# Altium schematic sheet NCKH_sch.SchDoc
size A0
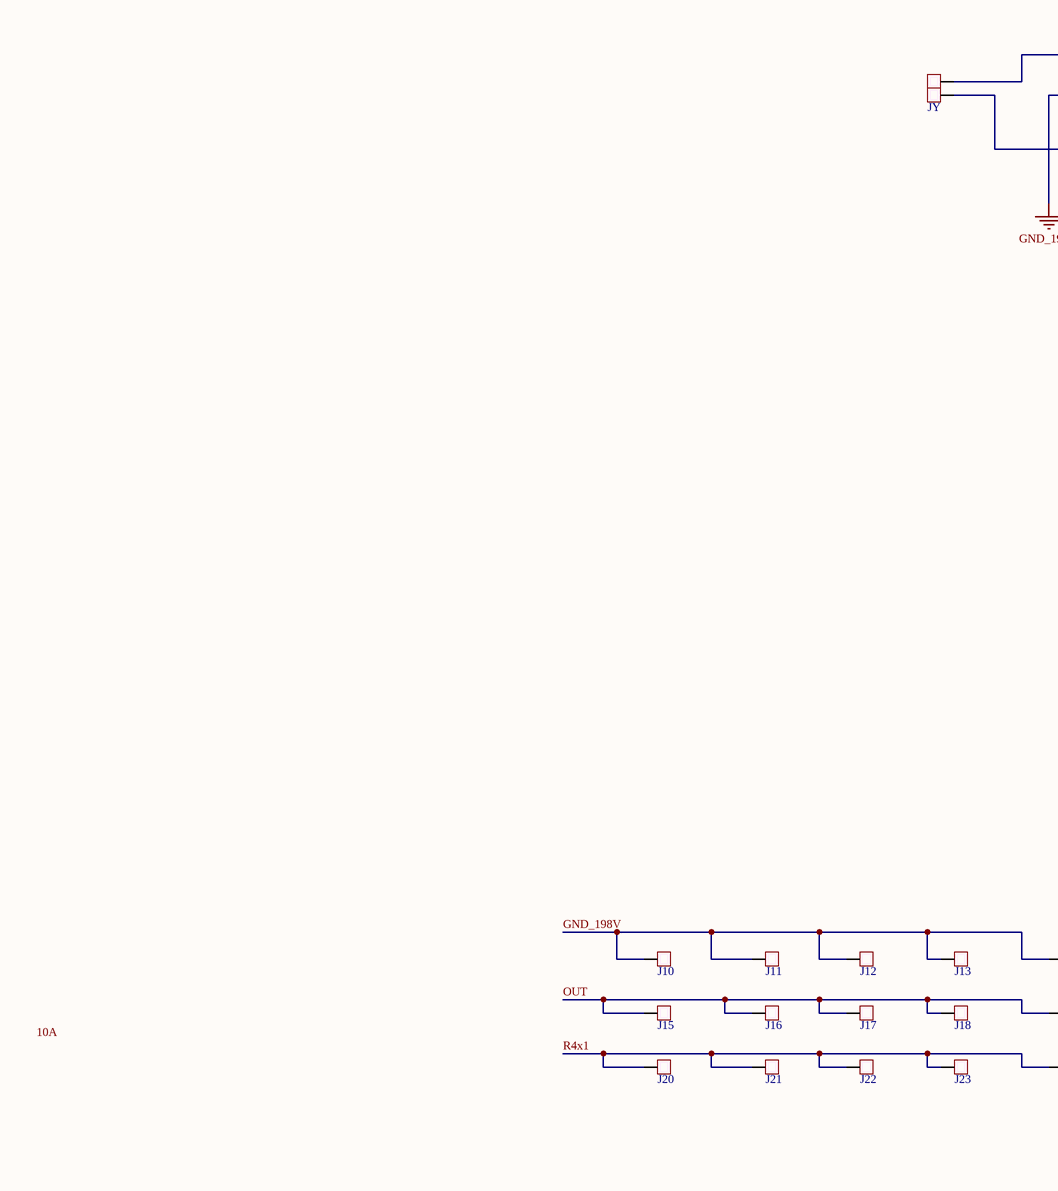
[diagram p0: NCKH_sch.SchDoc, left]
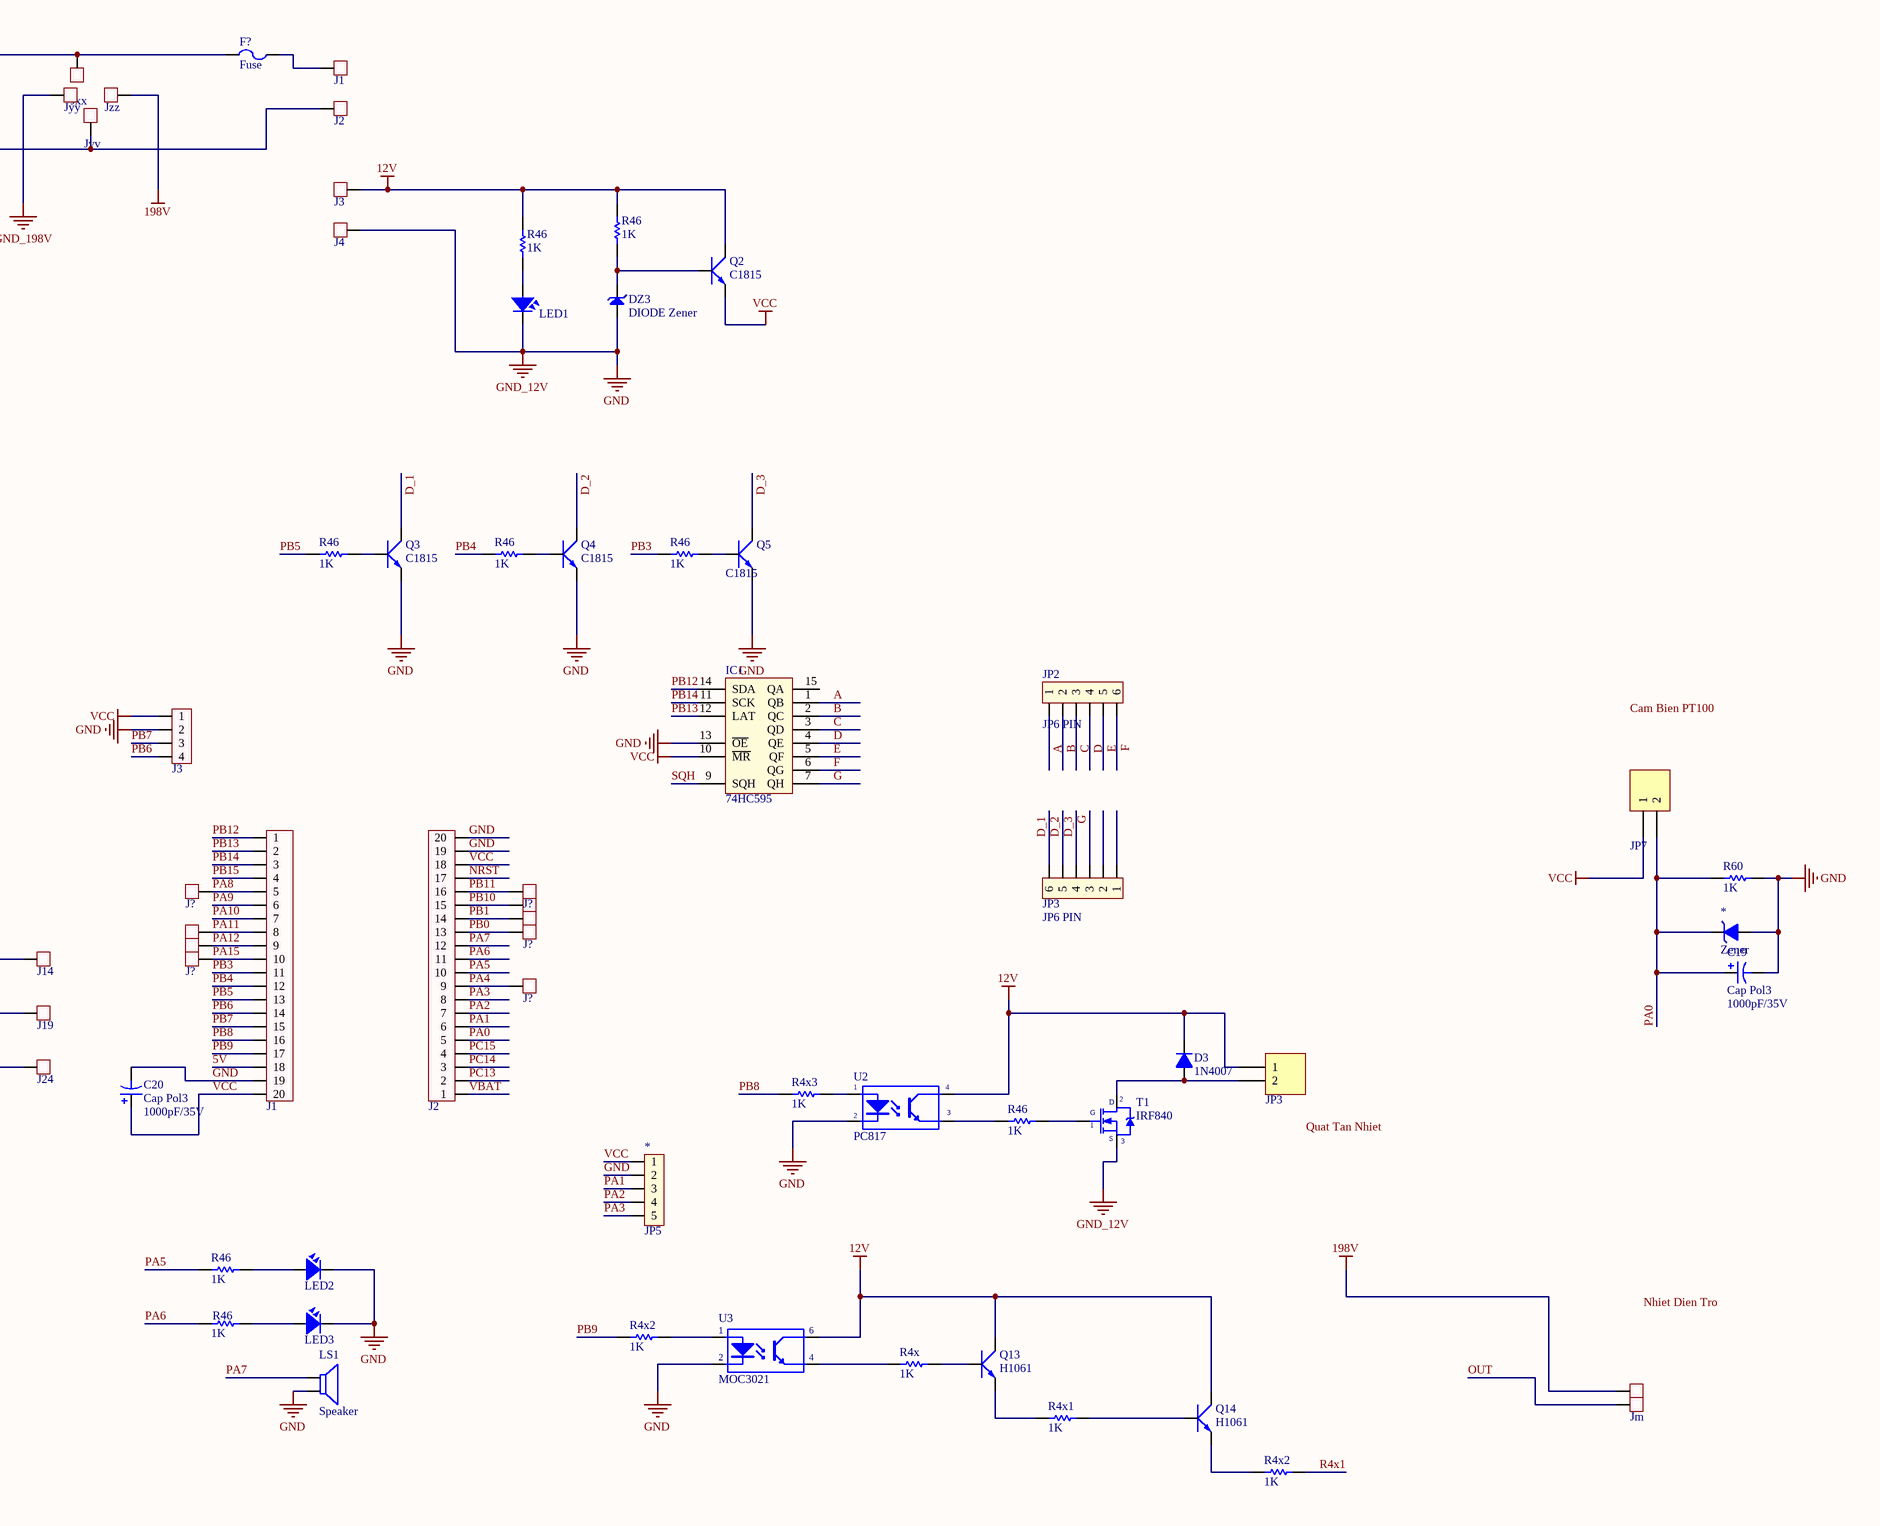
[diagram p1: NCKH_sch.SchDoc, right]

## Parts
(Parts that share a designator on the sheet are numbered #1, #2 ... from top to bottom, then left to right.)
*#1  Zener  [D1A]
*#2  JP5  [JP5]
C19  Cap Pol3  value 1000pF/35V  [CA-040,015]
C20  Cap Pol3  value 1000pF/35V  [CA-040,015]
D3  1N4007  [D1A]
DZ3  DIODE Zener  [DIO-1A]
F?  Fuse  [Fuse4]
IC1  74HC595  [DIP16/W0.3]
J1#1  JP1  [JP1-D1T]  (value not drawn)
J1#2  JP20  [JP20-C1T]  (value not drawn)
J2#1  JP1  [JP1-D1T]  (value not drawn)
J2#2  JP20  [JP20-C1T]  (value not drawn)
J3#1  JP1  [JP1-D1T]  (value not drawn)
J3#2  JP4  [JP4-C1T]  (value not drawn)
J4  JP1  [JP1-D1T]  (value not drawn)
J10  JP1  [JP1-D1T]  (value not drawn)
J11  JP1  [JP1-D1T]  (value not drawn)
J12  JP1  [JP1-D1T]  (value not drawn)
J13  JP1  [JP1-D1T]  (value not drawn)
J14  JP1  [JP1-D1T]  (value not drawn)
J15  JP1  [JP1-D1T]  (value not drawn)
J16  JP1  [JP1-D1T]  (value not drawn)
J17  JP1  [JP1-D1T]  (value not drawn)
J18  JP1  [JP1-D1T]  (value not drawn)
J19  JP1  [JP1-D1T]  (value not drawn)
J20  JP1  [JP1-D1T]  (value not drawn)
J21  JP1  [JP1-D1T]  (value not drawn)
J22  JP1  [JP1-D1T]  (value not drawn)
J23  JP1  [JP1-D1T]  (value not drawn)
J24  JP1  [JP1-D1T]  (value not drawn)
J?#1  JP1  [JP1-D1T]  (value not drawn)
J?#2  JP1  [JP1-D1T]  (value not drawn)
J?#3  JP1  [JP1-D1T]  (value not drawn)
J?#4  JP1  [JP1-D1T]  (value not drawn)
J?#5  JP1  [JP1-D1T]  (value not drawn)
J?#6  JP1  [JP1-D1T]  (value not drawn)
J?#7  JP1  [JP1-D1T]  (value not drawn)
J?#8  JP1  [JP1-D1T]  (value not drawn)
J?#9  JP1  [JP1-D1T]  (value not drawn)
Jk  JP1  [JP1-D1T]  (value not drawn)
Jm  JP1  [JP1-D1T]  (value not drawn)
JP2  JP6 PIN  [JP6]
JP3#1  JP6 PIN  [JP6]
JP3#2  Header 2_1  [HED2]  (value not drawn)
JP7  Header 2_1  [HED2]  (value not drawn)
Jvv  JP1  [JP1-D1T]  (value not drawn)
JX  JP1  [JP1-D1T]  (value not drawn)
Jxx  JP1  [JP1-D1T]  (value not drawn)
JY  JP1  [JP1-D1T]  (value not drawn)
Jyy  JP1  [JP1-D1T]  (value not drawn)
Jzz  JP1  [JP1-D1T]  (value not drawn)
LED1  LED  [LED-3]  (value not drawn)
LED2  LED  [LED-3]  (value not drawn)
LED3  LED  [LED-3]  (value not drawn)
LS1  Speaker  [SPEAKER]
Q2  C1815  [QTO-92]
Q3  C1815  [QTO-92]
Q4  C1815  [QTO-92]
Q5  C1815  [QTO-92]
Q13  H1061  [QTO-220]
Q14  H1061  [QTO-220]
R4x  value 1K  [R1/4W]  (hidden comment: Res1)
R4x1  value 1K  [R1/4W]  (hidden comment: Res1)
R4x2#1  value 1K  [R1/4W]  (hidden comment: Res1)
R4x2#2  value 1K  [R1/4W]  (hidden comment: Res1)
R4x3  value 1K  [R1/4W]  (hidden comment: Res1)
R46#1  value 1K  [R1/4W]  (hidden comment: Res1)
R46#2  value 1K  [R1/4W]  (hidden comment: Res1)
R46#3  value 1K  [R1/4W]  (hidden comment: Res1)
R46#4  value 1K  [R1/4W]  (hidden comment: Res1)
R46#5  value 1K  [R1/4W]  (hidden comment: Res1)
R46#6  value 1K  [R1/4W]  (hidden comment: Res1)
R46#7  value 1K  [R1/4W]  (hidden comment: Res1)
R46#8  value 1K  [R1/4W]  (hidden comment: Res1)
R60  value 1K  [R1/4W]  (hidden comment: Res1)
T1  IRF840  [TO220H1]
U2  PC817  [DIP4/W0.3]
U3  MOC3021  [DIP6/W0.3]

## Nets
12V: D3.2(K) J3#1.1 JP3#2.1 Q2.2(C) Q13.2(C) Q14.2(C) R46#1.1 R46#2.2 U2.4(C) U3.6(C)
198V: Jk.1 Jzz.1
GND: *#1.1(A) *#2.2 C19.2 C20.2 DZ3.1(A) IC1.8(GND) IC1.13(~{OE}) J1#2.19 J2#2.19 J2#2.20 J3#2.2 J4.1 LED1.2 LED2.2 LED3.2 LS1.2 Q3.1(E) Q4.1(E) Q5.1(E) R60.1 T1.3(S) U2.2(K) U3.2(K)  [also labelled GND_12V]
GND_198V: J10.1 J11.1 J12.1 J13.1 J14.1 Jyy.1
VCC: *#2.1 C20.1 IC1.10(~{MR}) IC1.16(VCC) J1#2.20 J2#2.18 J3#2.1 JP7.1 Q2.1(E)
5V: J1#2.18
A: IC1.1(QB) JP2.1
B: IC1.2(QC) JP2.2
C: IC1.3(QD) JP2.3
D: IC1.4(QE) JP2.4
D_1: JP3#1.6 Q3.2(C)
D_2: JP3#1.5 Q4.2(C)
D_3: JP3#1.4 Q5.2(C)
E: IC1.5(QF) JP2.5
F: IC1.6(QG) JP2.6
G: IC1.7(QH) JP3#1.3
NRST: J2#2.17
OUT: J15.1 J16.1 J17.1 J18.1 J19.1 Jm.1
PA0: *#1.2(K) C19.1 J2#2.5 JP7.2 R60.2
PA1: *#2.3 J2#2.6
PA2: *#2.4 J2#2.7
PA3: *#2.5 J2#2.8
PA4: J2#2.9 J?#9.1
PA5: J2#2.10 R46#7.2
PA6: J2#2.11 R46#8.2
PA7: J2#2.12 LS1.1
PA8: J1#2.5 J?#1.1
PA9: J1#2.6
PA10: J1#2.7
PA11: J1#2.8 J?#5.1
PA12: J1#2.9 J?#7.1
PA15: J1#2.10 J?#8.1
PB0: J2#2.13 J?#6.1
PB1: J2#2.14 J?#4.1
PB3: J1#2.11 R46#5.2
PB4: J1#2.12 R46#4.2
PB5: J1#2.13 R46#3.2
PB6: J1#2.14 J3#2.4
PB7: J1#2.15 J3#2.3
PB8: J1#2.16 R4x3.2
PB9: J1#2.17 R4x2#1.2
PB10: J2#2.15 J?#3.1
PB11: J2#2.16 J?#2.1
PB12: IC1.14(SDA) J1#2.1
PB13: IC1.12(LAT) J1#2.2
PB14: IC1.11(SCK) J1#2.3
PB15: J1#2.4
PC13: J2#2.2
PC14: J2#2.3
PC15: J2#2.4
R4x1: J20.1 J21.1 J22.1 J23.1 J24.1 R4x2#2.1
SQH: IC1.9(SQH)
VBAT: J2#2.1
NetD3_1: D3.1(A) JP3#2.2 T1.2(D)
NetDZ3_2: DZ3.2(K) Q2.3(B) R46#1.2
NetF?_1: F?.1 JX.1 Jxx.1
NetF?_2: F?.2 J1#1.1
NetJ2#1_1: J2#1.1 Jvv.1 JY.1
NetLED1_1: LED1.1 R46#2.1
NetLED2_1: LED2.1 R46#7.1
NetLED3_1: LED3.1 R46#8.1
NetQ3_3: Q3.3(B) R46#3.1
NetQ4_3: Q4.3(B) R46#4.1
NetQ5_3: Q5.3(B) R46#5.1
NetQ13_1: Q13.1(B) R4x.1
NetQ13_3: Q13.3(E) R4x1.2
NetQ14_1: Q14.1(B) R4x1.1
NetQ14_3: Q14.3(E) R4x2#2.2
NetR4x2#1_1: R4x2#1.1 U3.1(A)
NetR4x3_1: R4x3.1 U2.1(A)
NetR4x_2: R4x.2 U3.4(E)
NetR46#6_1: R46#6.1 T1.1(G)
NetR46#6_2: R46#6.2 U2.3(E)

Not connected (* = marked no-connect by the designer): IC1 15(QA); JP3#1 1 2

## Notes on the sheet
- Labels drawn without touching a wire or pin: 10A, Cam Bien PT100, Nhiet Dien Tro, Quat Tan Nhiet
- Title
- Size:
- Date:
- File:
- A0
- Number:
- Time:
- Revision:
- Sheet
- of

## Library data of the parts
C19 = Cap Pol3_1: Polarized Capacitor (Surface Mount); VALUE: C?; LatestRevisionDate: 17-Jul-2002; LatestRevisionNote: Re-released for DXP Platform.; PackageReference: C0805; Publisher: Altium Limited
C20 = Cap Pol3_2: Polarized Capacitor (Surface Mount); VALUE: C?; LatestRevisionDate: 17-Jul-2002; LatestRevisionNote: Re-released for DXP Platform.; PackageReference: C0805; Publisher: Altium Limited
D3 = D1A: Diode 1A; Value: 1N4007
DZ3 = DIODE Zener: DIODE GEN PURP 75V 200MA LLDS
F? = Fuse: FUSE GLASS 200MA 250VAC 5X20MM
IC1 = 74595: 8 Bit Serial input - Parallel Output; Value: 74HC595
J1#1 J2#1 J3#1 J4 J10-J24 J?#1-J?#9 Jk Jm Jvv JX Jxx JY Jyy Jzz = JP1: WR-PHD 2.54 mm Angled Socket Header
J1#2 J2#2 = JP20: WR-PHD 2.54 mm Angled Socket Header
J3#2 = JP4: WR-PHD 2.54 mm Angled Socket Header
JP2 JP3#1 = JP6: Value: JP7
JP3#2 JP7 = Header 2_1: Header, 2-Pin; Manufacturer: Generic Components; Class: Connector; Value: Header 2
LED1-LED3 = LED: LED Single colour Green and Red; Value: LED 3 ly Single Colour
LS1 = Speaker: Speakers & Transducers SPEAKER 17mm
Q2-Q5 = C1815: NPN 600mW, ECB; Value: C1815
Q13 Q14 = NPN_BCE: P 1W, BCE; Value: TIP41
R4x R4x1 R4x2#1 R4x2#2 R4x3 R46#1-R46#8 R60 = Res1_1: Resistor; Manufacturer: Generic Components; Class: Passive; Published: 08/06/2000; Publisher: Altium Hobart Technology Centre; SubClass: Resistor
T1 = IRF840: MOSFET N-CH 500V 8A TO-220
U2 = PC817: Single Opto; Value: PC817
U3 = MOC3021: Single Opto; Value: MOC3021